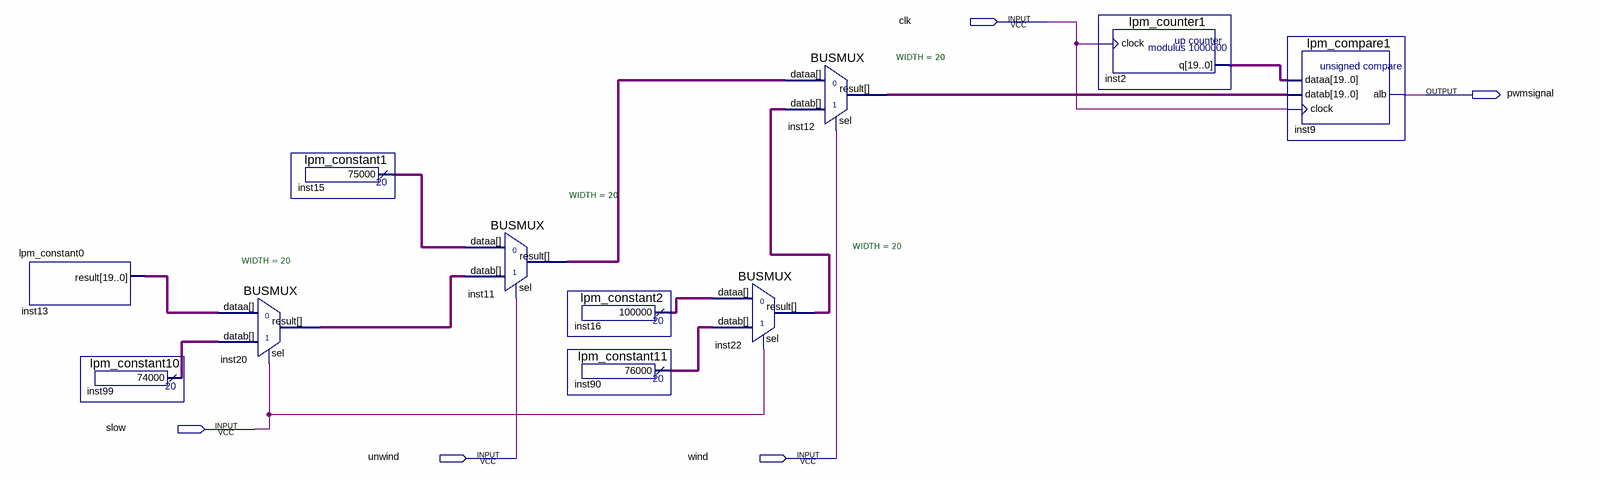
[diagram p0: schematic sheet]
// Quartus schematic servo.bdf as structural Verilog: 11 symbols, 5 pins
module servo (
  input  clk,
  input  slow,
  input  unwind,
  input  wind,
  output pwmsignal
);

  wire [19:0] inst2_q, inst11_result, inst12_result, inst13_result, inst15_result, inst16_result,
       inst20_result, inst22_result, inst90_result, inst99_result;

  lpm_constant0 inst13 (.result(inst13_result));
  lpm_constant10 inst99 (.result(inst99_result));
  BUSMUX #(.WIDTH(20)) inst20 (.datab(inst99_result), .sel(slow), .dataa(inst13_result), .result(inst20_result));
  lpm_constant1 inst15 (.result(inst15_result));
  BUSMUX #(.WIDTH(20)) inst11 (.datab(inst20_result), .sel(unwind), .dataa(inst15_result), .result(inst11_result));
  lpm_constant2 inst16 (.result(inst16_result));
  lpm_constant11 inst90 (.result(inst90_result));
  BUSMUX #(.WIDTH(20)) inst22 (.datab(inst90_result), .sel(slow), .dataa(inst16_result), .result(inst22_result));
  BUSMUX #(.WIDTH(20)) inst12 (.datab(inst22_result), .sel(wind), .dataa(inst11_result), .result(inst12_result));
  lpm_counter1 inst2 (.clock(clk), .q(inst2_q));
  lpm_compare1 inst9 (.dataa(inst2_q), .datab(inst12_result), .clock(clk), .alb(pwmsignal));
endmodule
